# Altium project PCB_Project1.PrjPCB
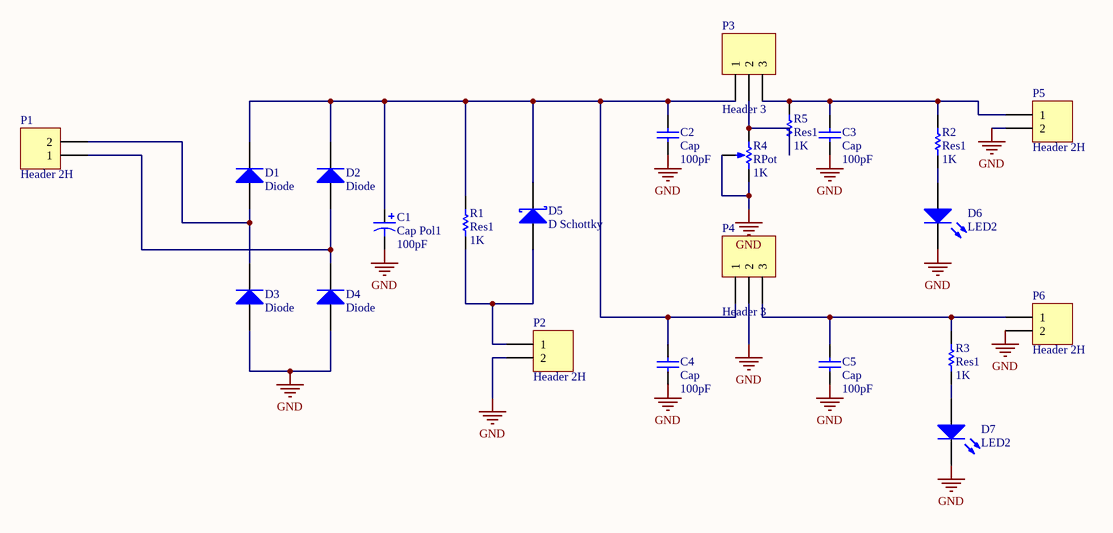
[diagram p0: LPS.SchDoc]
1 sheet, 23 parts. Net scope: global (net labels, ports and power ports of the same name join across sheets).
Board file: LPS PCB.PcbDoc

## Sheet LPS.SchDoc
size A

### Parts
C1  Cap Pol1  value 100pF  [CAPR5-4X5]
C2  Cap  value 100pF  [RAD-0.3]
C3  Cap  value 100pF  [RAD-0.3]
C4  Cap  value 100pF  [RAD-0.3]
C5  Cap  value 100pF  [RAD-0.3]
D1  Diode  [DIODE-0.7]
D2  Diode  [DIODE-0.7]
D3  Diode  [DIODE-0.7]
D4  Diode  [DIODE-0.7]
D5  D Schottky  [DIODE-0.7]
D6  LED2  [DIODE-0.7]
D7  LED2  [DIODE-0.7]
P1  Header 2H  [HDR1X2H]
P2  Header 2H  [HDR1X2H]
P3  Header 3  [HDR1X3]
P4  Header 3  [HDR1X3]
P5  Header 2H  [HDR1X2H]
P6  Header 2H  [HDR1X2H]
R1  Res1  value 1K  [AXIAL-0.3]
R2  Res1  value 1K  [AXIAL-0.3]
R3  Res1  value 1K  [AXIAL-0.3]
R4  RPot  value 1K  [VR5]
R5  Res1  value 1K  [AXIAL-0.3]

### Nets
GND: C1.2 C2.1 C3.1 C4.1 C5.1 D3.1(A) D4.1(A) D6.2(K) D7.2(K) P2.2 P4.2 P5.2 P6.2 R4.2(BOT) R4.3(TAP)
NetC1_1: C1.1 C2.2 C4.2 D1.2(K) D2.2(K) D5.2(K) P3.1 P4.1 R1.2
NetC3_2: C3.2 P3.3 P5.1 R2.2 R5.2
NetC5_2: C5.2 P4.3 P6.1 R3.2
NetD1_1: D1.1(A) D3.2(K) P1.2
NetD2_1: D2.1(A) D4.2(K) P1.1
NetD5_1: D5.1(A) P2.1 R1.1
NetD6_1: D6.1(A) R2.1
NetD7_1: D7.1(A) R3.1
NetP3_2: P3.2 R4.1(TOP) R5.1

### Library data of the parts
C1 = Cap Pol1: Polarized Capacitor (Radial); Published: 8-Jun-2000; LatestRevisionDate: 17-Jul-2002; LatestRevisionNote: Re-released for DXP Platform.; PackageReference: RB7.6-15; Publisher: Altium Limited; PackageDescription: Polarized Capacitor (Radial); 2 Leads
C2-C5 = Cap: Capacitor; Published: 8-Jun-2000; LatestRevisionDate: 17-Jul-2002; LatestRevisionNote: Re-released for DXP Platform.; PackageReference: RAD-0.3; Publisher: Altium Limited; PackageDescription: Radial Cap, Thru-Hole; 2 Leads; 0.3 in Pin Spacing
D1-D4 = Diode: Default Diode; Published: 8-Jun-2000; LatestRevisionDate: 17-Jul-2002; LatestRevisionNote: Re-released for DXP Platform.; PackageVersion: Sep-1996; PackageReference: SMC; Publisher: Altium Limited; PackageDescription: DO-214-AB/SMC; 2 C-Bend Leads; Body 7.9 x 5.9 mm, inc. leads (LxW); Code_JEDEC: DO-214-AB
D5 = D Schottky: Schottky Diode; Published: 8-Jun-2000; LatestRevisionDate: 17-Jul-2002; LatestRevisionNote: Re-released for DXP Platform.; PackageReference: SMB; Publisher: Altium Limited; PackageDescription: DO-214-AA/SMB; 2 C-Bend Leads; Body 5.3 x 3.6 mm, inc. leads (LxW); Code_JEDEC: DO-214-AA
D6 D7 = LED2: Typical RED, GREEN, YELLOW, AMBER GaAs LED; Published: 8-Jun-2000; LatestRevisionDate: 17-Jul-2002; LatestRevisionNote: Re-released for DXP Platform.; PackageVersion: Feb-2002; PackageReference: 3.2X1.6X1.1; Publisher: Altium Limited; PackageDescription: SM LED; 2 Flat Leads
P1 P2 P5 P6 = Header 2H: Header, 2-Pin, Right Angle; LatestRevisionDate: 17-Jul-2002; LatestRevisionNote: Re-released for DXP Platform.; Publisher: Altium Limited
P3 P4 = Header 3: Header, 3-Pin; LatestRevisionDate: 17-Jul-2002; LatestRevisionNote: Re-released for DXP Platform.; Publisher: Altium Limited
R1-R3 R5 = Res1: Resistor; Published: 8-Jun-2000; LatestRevisionDate: 17-Jul-2002; LatestRevisionNote: Re-released for DXP Platform.; PackageReference: AXIAL-0.3; Publisher: Altium Limited; PackageDescription: Axial Device, Thru-Hole; 2 Leads; 0.3 in Pin Spacing
R4 = RPot: Potentiometer; Sim Note: Enter the Resistance value and the set point into parameter fields.; Set Position: 0.5; Published: 8-Jun-2000; LatestRevisionDate: 17-Jul-2002; LatestRevisionNote: Re-released for DXP Platform.; PackageReference: VR5; Publisher: Altium Limited; PackageDescription: Variable Resistor, Thru-Hole; 3 Leads